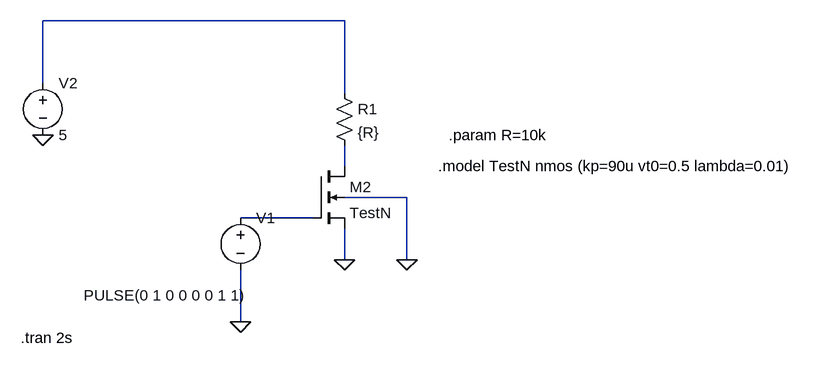
[diagram p0: schematic common_source.asc]
common_source.asc, the LTspice schematic file:
Version 4
SHEET 1 940 680
WIRE 192 -112 -272 -112
WIRE -272 -16 -272 -112
WIRE 192 0 192 -112
WIRE 192 112 192 80
WIRE 288 160 192 160
WIRE 144 192 32 192
WIRE 192 256 192 208
WIRE 288 256 288 160
WIRE 32 352 32 272
FLAG -272 64 0
FLAG 192 256 0
FLAG 32 352 0
FLAG 288 256 0
SYMBOL voltage 32 176 R0
WINDOW 3 -241 135 Left 2
WINDOW 123 0 0 Left 0
WINDOW 39 0 0 Left 0
SYMATTR InstName V1
SYMATTR Value PULSE(0 1 0 0 0 0 1 1)
SYMBOL res 176 -16 R0
SYMATTR InstName R1
SYMATTR Value {R}
SYMBOL voltage -272 -32 R0
WINDOW 123 0 0 Left 0
WINDOW 39 0 0 Left 0
SYMATTR InstName V2
SYMATTR Value 5
SYMBOL nmos4 144 112 R0
SYMATTR InstName M2
SYMATTR Value TestN
SYMATTR Value2 l=1u w=10u
TEXT 336 112 Left 2 !.model TestN nmos (kp=90u vt0=0.5 lambda=0.01)
TEXT 352 64 Left 2 !.param R=10k
TEXT -306 376 Left 2 !.tran 2s

The netlist it stands for:
* common_source.asc
V1 N003 0 PULSE(0 1 0 0 0 0 1 1)
R1 N001 N002 {R}
V2 N001 0 5
M2 N002 N003 0 0 TestN l=1u w=10u
.model NMOS NMOS
.model PMOS PMOS
.lib standard.mos
.model TestN nmos (kp=90u vt0=0.5 lambda=0.01)
.param R=10k
.tran 2s
.backanno
.end